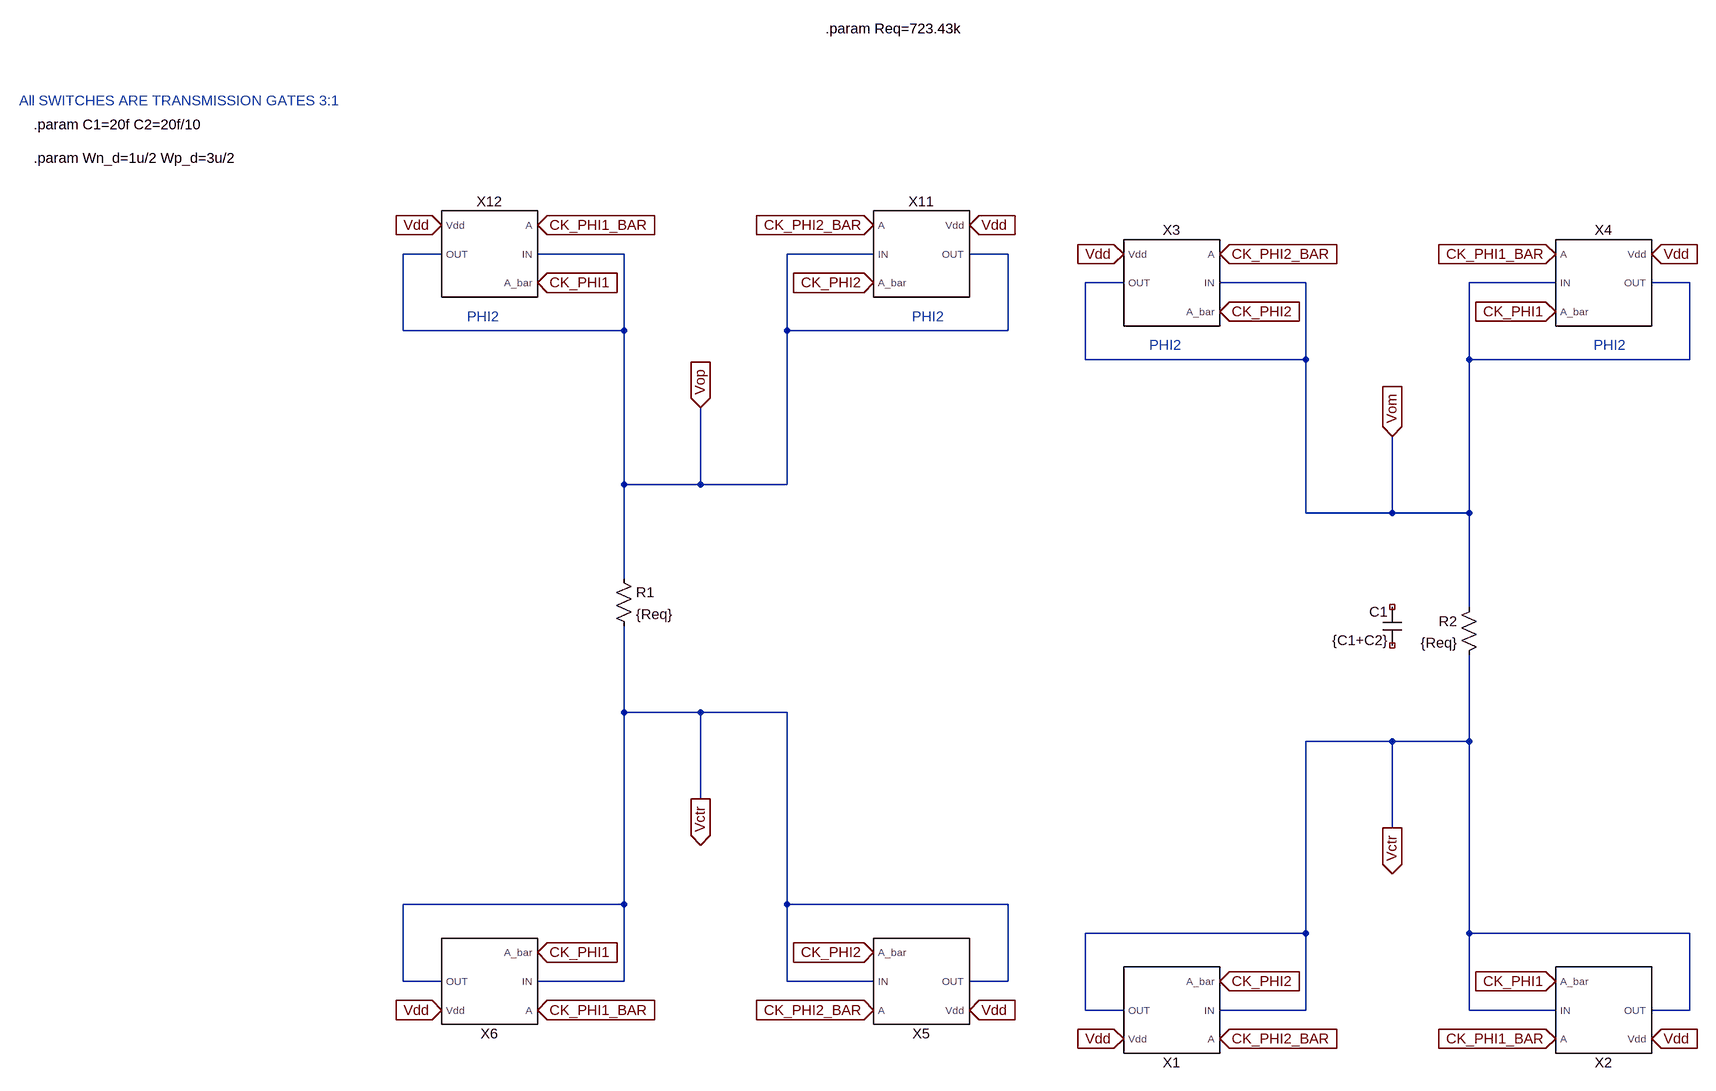
[diagram p0: schematic Draft9.asc]
Draft9.asc, the LTspice schematic file:
Version 4
SHEET 1 2872 680
WIRE -3136 -864 -3200 -864
WIRE -2832 -864 -2976 -864
WIRE -2416 -864 -2560 -864
WIRE -2192 -864 -2256 -864
WIRE -672 -816 -736 -816
WIRE -368 -816 -512 -816
WIRE 48 -816 -96 -816
WIRE 272 -816 208 -816
WIRE -3200 -736 -3200 -864
WIRE -2832 -736 -2832 -864
WIRE -2832 -736 -3200 -736
WIRE -2560 -736 -2560 -864
WIRE -2192 -736 -2192 -864
WIRE -2192 -736 -2560 -736
WIRE -736 -688 -736 -816
WIRE -368 -688 -368 -816
WIRE -368 -688 -736 -688
WIRE -96 -688 -96 -816
WIRE 272 -688 272 -816
WIRE 272 -688 -96 -688
WIRE -2832 -480 -2832 -736
WIRE -2704 -480 -2704 -608
WIRE -2704 -480 -2832 -480
WIRE -2560 -480 -2560 -736
WIRE -2560 -480 -2704 -480
WIRE -368 -432 -368 -688
WIRE -224 -432 -224 -560
WIRE -224 -432 -368 -432
WIRE -96 -432 -96 -688
WIRE -96 -432 -224 -432
WIRE -2832 -320 -2832 -480
WIRE -96 -272 -96 -432
WIRE -2832 -96 -2832 -240
WIRE -2704 -96 -2832 -96
WIRE -2560 -96 -2704 -96
WIRE -224 -48 -368 -48
WIRE -96 -48 -96 -192
WIRE -96 -48 -224 -48
WIRE -2704 48 -2704 -96
WIRE -224 96 -224 -48
WIRE -2832 224 -2832 -96
WIRE -2832 224 -3200 224
WIRE -2560 224 -2560 -96
WIRE -2192 224 -2560 224
WIRE -368 272 -368 -48
WIRE -368 272 -736 272
WIRE -96 272 -96 -48
WIRE 272 272 -96 272
WIRE -3200 352 -3200 224
WIRE -3136 352 -3200 352
WIRE -2832 352 -2832 224
WIRE -2832 352 -2976 352
WIRE -2560 352 -2560 224
WIRE -2416 352 -2560 352
WIRE -2192 352 -2192 224
WIRE -2192 352 -2256 352
WIRE -736 400 -736 272
WIRE -672 400 -736 400
WIRE -368 400 -368 272
WIRE -368 400 -512 400
WIRE -96 400 -96 272
WIRE 48 400 -96 400
WIRE 272 400 272 272
WIRE 272 400 208 400
FLAG -2704 -608 Vop
IOPIN -2704 -608 In
FLAG -2704 48 Vctr
IOPIN -2704 48 Out
FLAG -2256 400 Vdd
IOPIN -2256 400 In
FLAG -2416 400 CK_PHI2_BAR
IOPIN -2416 400 In
FLAG -2416 304 CK_PHI2
IOPIN -2416 304 In
FLAG -3136 400 Vdd
IOPIN -3136 400 In
FLAG -2976 400 CK_PHI1_BAR
IOPIN -2976 400 In
FLAG -2976 304 CK_PHI1
IOPIN -2976 304 In
FLAG -2256 -912 Vdd
IOPIN -2256 -912 In
FLAG -2416 -912 CK_PHI2_BAR
IOPIN -2416 -912 In
FLAG -2416 -816 CK_PHI2
IOPIN -2416 -816 In
FLAG -3136 -912 Vdd
IOPIN -3136 -912 In
FLAG -2976 -912 CK_PHI1_BAR
IOPIN -2976 -912 In
FLAG -2976 -816 CK_PHI1
IOPIN -2976 -816 In
FLAG -224 -560 Vom
IOPIN -224 -560 In
FLAG -224 96 Vctr
IOPIN -224 96 Out
FLAG -672 448 Vdd
IOPIN -672 448 In
FLAG -512 448 CK_PHI2_BAR
IOPIN -512 448 In
FLAG -512 352 CK_PHI2
IOPIN -512 352 In
FLAG 208 448 Vdd
IOPIN 208 448 In
FLAG 48 448 CK_PHI1_BAR
IOPIN 48 448 In
FLAG 48 352 CK_PHI1
IOPIN 48 352 In
FLAG -672 -864 Vdd
IOPIN -672 -864 In
FLAG -512 -864 CK_PHI2_BAR
IOPIN -512 -864 In
FLAG -512 -768 CK_PHI2
IOPIN -512 -768 In
FLAG 208 -864 Vdd
IOPIN 208 -864 In
FLAG 48 -864 CK_PHI1_BAR
IOPIN 48 -864 In
FLAG 48 -768 CK_PHI1
IOPIN 48 -768 In
SYMBOL tgate -2336 352 M180
SYMATTR SpiceLine L=0.28u Wn={Wn_d} Wp={Wp_d} M=1
SYMATTR InstName X5
SYMBOL tgate -3056 352 R180
SYMATTR SpiceLine L=0.28u Wn={Wn_d} Wp={Wp_d} M=1
SYMATTR InstName X6
SYMBOL tgate -2336 -864 R0
SYMATTR SpiceLine L=0.28u Wn={Wn_d} Wp={Wp_d} M=1
SYMATTR InstName X11
SYMBOL tgate -3056 -864 M0
SYMATTR SpiceLine L=0.28u Wn={Wn_d} Wp={Wp_d} M=1
SYMATTR InstName X12
SYMBOL res -2848 -336 R0
SYMATTR InstName R1
SYMATTR Value {Req}
SYMBOL cap -208 -272 M0
SYMATTR InstName C1
SYMATTR Value {C1+C2}
SYMBOL tgate -592 400 R180
SYMATTR SpiceLine L=0.28u Wn={Wn_d} Wp={Wp_d} M=1
SYMATTR InstName X1
SYMBOL tgate 128 400 M180
SYMATTR SpiceLine L=0.28u Wn={Wn_d} Wp={Wp_d} M=1
SYMATTR InstName X2
SYMBOL tgate -592 -816 M0
SYMATTR SpiceLine L=0.28u Wn={Wn_d} Wp={Wp_d} M=1
SYMATTR InstName X3
SYMBOL tgate 128 -816 R0
SYMATTR SpiceLine L=0.28u Wn={Wn_d} Wp={Wp_d} M=1
SYMATTR InstName X4
SYMBOL res -80 -288 M0
SYMATTR InstName R2
SYMATTR Value {Req}
TEXT -3816 -1080 Left 2 !.param C1=20f C2=20f/10
TEXT -3840 -1120 Left 2 ;All SWITCHES ARE TRANSMISSION GATES 3:1
TEXT -3816 -1024 Left 2 !.param Wn_d=1u/2 Wp_d=3u/2
TEXT -2352 -760 Left 2 ;PHI2
TEXT -3040 -760 Right 2 ;PHI2
TEXT -2496 -1240 Left 2 !.param Req=723.43k
TEXT -576 -712 Right 2 ;PHI2
TEXT 112 -712 Left 2 ;PHI2

The netlist it stands for:
* Draft9.asc
XX5 CK_PHI2_BAR CK_PHI2 Vctr Vdd Vctr tgate L=0.28u Wn={Wn_d} Wp={Wp_d} M=1  ; pins A A_bar IN Vdd OUT
XX6 CK_PHI1_BAR CK_PHI1 Vctr Vdd Vctr tgate L=0.28u Wn={Wn_d} Wp={Wp_d} M=1  ; pins A A_bar IN Vdd OUT
XX11 CK_PHI2_BAR CK_PHI2 Vop Vdd Vop tgate L=0.28u Wn={Wn_d} Wp={Wp_d} M=1  ; pins A A_bar IN Vdd OUT
XX12 CK_PHI1_BAR CK_PHI1 Vop Vdd Vop tgate L=0.28u Wn={Wn_d} Wp={Wp_d} M=1  ; pins A A_bar IN Vdd OUT
R1 Vop Vctr {Req}
C1 NC_01 NC_02 {C1+C2}
XX1 CK_PHI2_BAR CK_PHI2 Vctr Vdd Vctr tgate L=0.28u Wn={Wn_d} Wp={Wp_d} M=1  ; pins A A_bar IN Vdd OUT
XX2 CK_PHI1_BAR CK_PHI1 Vctr Vdd Vctr tgate L=0.28u Wn={Wn_d} Wp={Wp_d} M=1  ; pins A A_bar IN Vdd OUT
XX3 CK_PHI2_BAR CK_PHI2 Vom Vdd Vom tgate L=0.28u Wn={Wn_d} Wp={Wp_d} M=1  ; pins A A_bar IN Vdd OUT
XX4 CK_PHI1_BAR CK_PHI1 Vom Vdd Vom tgate L=0.28u Wn={Wn_d} Wp={Wp_d} M=1  ; pins A A_bar IN Vdd OUT
R2 Vom Vctr {Req}
.param C1=20f C2=20f/10
* All SWITCHES ARE TRANSMISSION GATES 3:1
.param Wn_d=1u/2 Wp_d=3u/2
* PHI2
* PHI2
.param Req=723.43k
* PHI2
* PHI2
.backanno
.end